# EAGLE design CSNE_Hirose_TDT_AdptBrd (EAGLE 7.4.0)

## Sheet 1 of 4
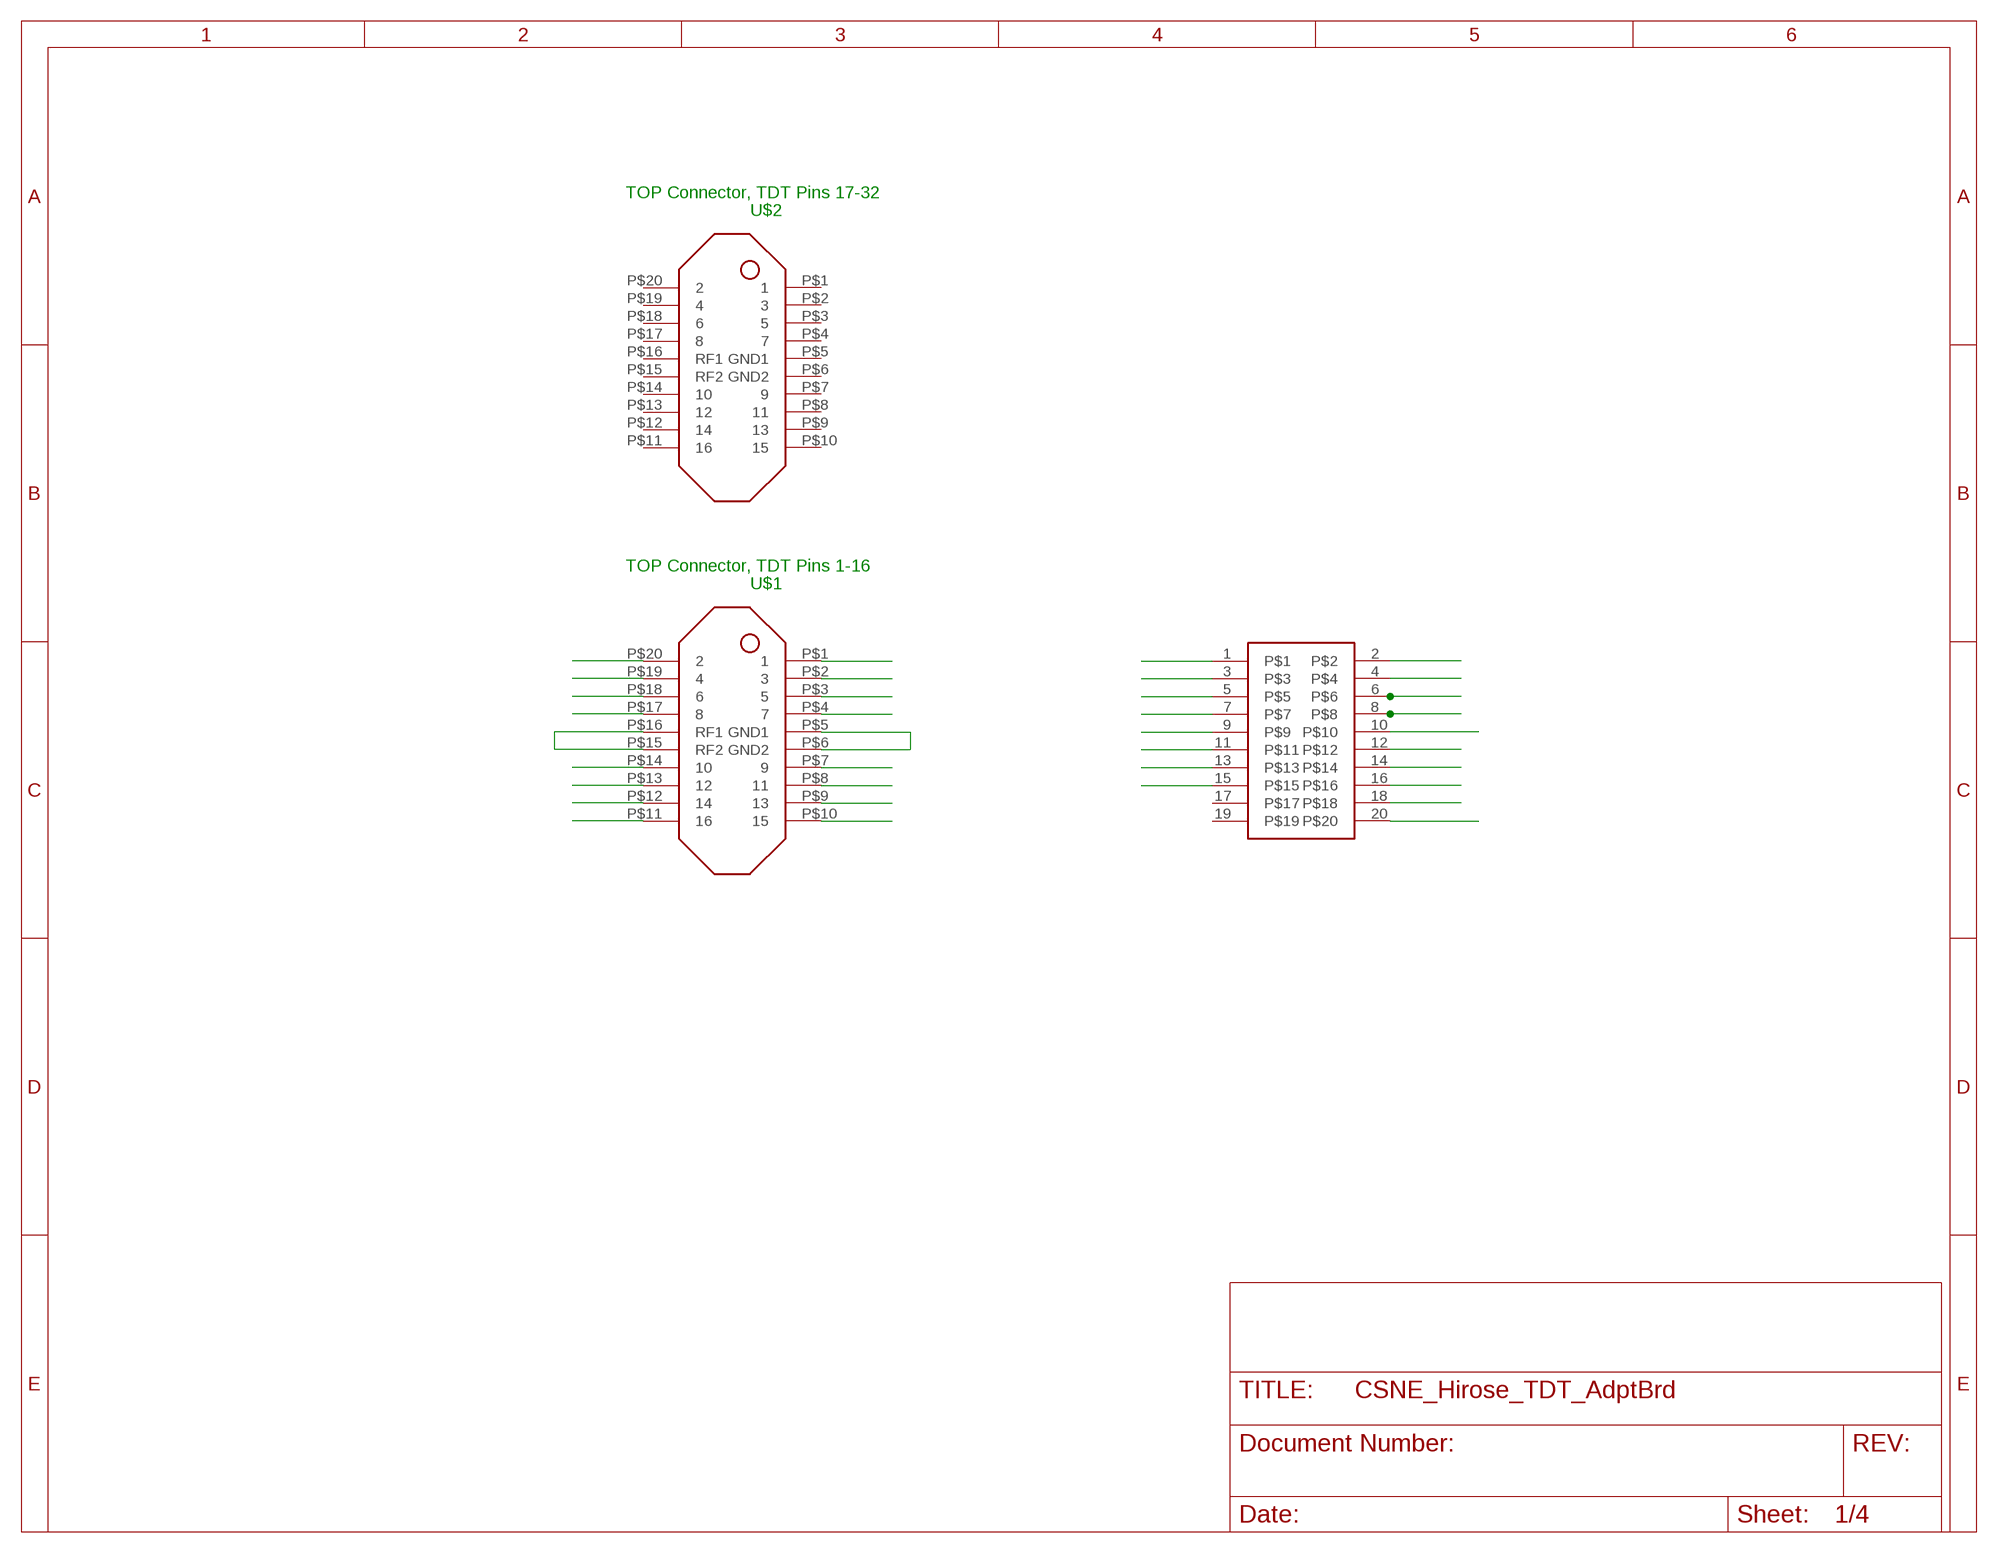
[diagram p0: schematic, sheet 1]

### Parts
U$1  DF30_HEADER  [DF30FC-20DP-0.4V]
U$2  DF30_HEADER  [DF30FC-20DP-0.4V]
U$3  CON-DF17-20F  [CON-DF17-20F]

### Nets
N$1: U$1.P$1 U$3.1
N$2: U$1.P$2 U$3.3
N$3: U$1.P$3 U$3.5
N$4: U$1.P$4 U$3.7
N$5: U$1.P$5(GND1) U$1.P$6(GND2) U$3.20
N$7: U$1.P$7 U$3.9
N$8: U$1.P$8 U$3.11
N$9: U$1.P$9 U$3.13
N$10: U$1.P$10 U$3.15
N$11: U$1.P$11 U$3.18
N$12: U$1.P$12 U$3.16
N$13: U$1.P$13 U$3.14
N$14: U$1.P$14 U$3.12
N$16: U$1.P$15(RF2) U$1.P$16(RF1) U$3.10
N$17: U$1.P$17 U$3.8
N$18: U$1.P$18 U$3.6
N$19: U$1.P$19 U$3.4
N$20: U$1.P$20 U$3.2
Unconnected: U$2.P$1 U$2.P$2 U$2.P$3 U$2.P$4 U$2.P$5(GND1) U$2.P$6(GND2) U$2.P$7 U$2.P$8 U$2.P$9 U$2.P$10 U$2.P$11 U$2.P$12 U$2.P$13 U$2.P$14 U$2.P$15(RF2) U$2.P$16(RF1) U$2.P$17 U$2.P$18 U$2.P$19 U$2.P$20 U$3.17 U$3.19

### Notes on the sheet
- TOP Connector, TDT Pins 17-32
- U$2
- TOP Connector, TDT Pins 1-16
- U$1

## Sheet 2 of 4

## Sheet 3 of 4

## Sheet 4 of 4

## Library data of the parts
U$1 U$2 = TDT_Connectors:DF30_HEADER
U$3 = hirose_DF17:CON-DF17-20F

## Board
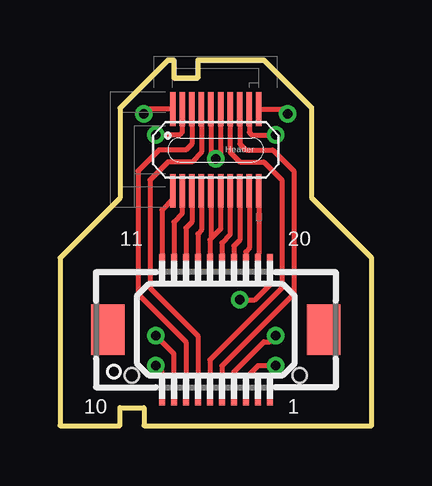
[diagram p1: board, top side]
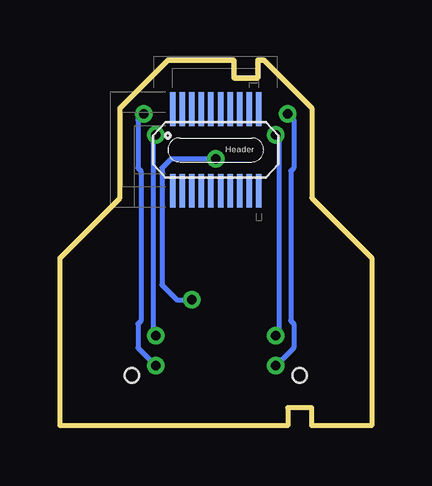
[diagram p2: board, bottom side, seen from below]

Size 13 x 15.25 mm. Coordinates in mm from the lower left corner, seen from the top.
Outline: 2.5,13.25 2.5,9.5 0,7 0,0 2.5,0 2.5,0.75 3.5,0.75 3.5,0 13,0 13,7 10.5,9.5 10.5,13.25 8.5,15.25 5.75,15.25 5.75,14.5 4.75,14.5 4.75,15.25 4.5,15.25 2.5,13.25
Copper layers (1*2*15*16): Top 0.035mm / dielectric 0.45mm / Route2 0.035mm / dielectric 0.5mm / Route15 0.035mm / dielectric 0.45mm / Bottom 0.035mm
Design rules "LaenPCBOrder_MOD_4layer": minimum track width 6mil, minimum drill 13mil, track to track 6mil, track to pad 6mil, pad to pad 6mil, via to via 6mil, smd to smd 6mil, copper to edge 15mil, drill to drill 6mil, minimum pad ring 7mil, minimum via ring 7mil, stop-mask expansion 3mil, vias tented up to drill 0mil, thermal gap 10mil

### Footprints (pad centres in the part's own frame; a part is rotated, then mirrored left to right if it is on the bottom)
DF30FC-20DP-0.4V = smd 0.23 x 1.4: P$1 -1.8,1.7; P$2 -1.4,1.7; P$3 -1,1.7; P$4 -0.6,1.7; P$5 -0.2,1.7; P$6 0.2,1.7; P$7 0.6,1.7; P$8 1,1.7; P$9 1.4,1.7; P$10 1.8,1.7; P$11 1.8,-1.7; P$12 1.4,-1.7; P$13 1,-1.7; P$14 0.6,-1.7; P$15 0.2,-1.7; P$16 -0.2,-1.7; P$17 -0.6,-1.7; P$18 -1,-1.7; P$19 -1.4,-1.7; P$20 -1.8,-1.7
CON-DF17-20F = smd 0.25 x 1.1: 1 -2.25,-2.6; 2 -2.25,2.6; 3 -1.75,-2.6; 4 -1.75,2.6; 5 -1.25,-2.6; 6 -1.25,2.6; 7 -0.75,-2.6; 8 -0.75,2.6; 9 -0.25,-2.6; 10 -0.25,2.6; 11 0.25,-2.6; 12 0.25,2.6; 13 0.75,-2.6; 14 0.75,2.6; 15 1.25,-2.6; 16 1.25,2.6; 17 1.75,-2.6; 18 1.75,2.6; 19 2.25,-2.6; 20 2.25,2.6 | smd 1.4 x 2.1: SIT1 -4.5,0; SIT2 4.5,0 | hole 0.6: -3.5,-1.9; 3.5,-1.9

### Placement (x,y rotation side)
U$1  6.5,11.5 0 top
U$2  6.5,11.5 0 bottom
U$3  6.5,4 0 top

### Tracks (layer width: path | path; a pad name or v marks a point on that pad's centre or on a via)
N$1  (via drill 0.38)
  Top 0.203: U$1.P$1 3.7,13.2 v3.5,13 | U$3.1 4.25,2.25 v4,2.5
  Bottom 0.203: v3.5,13 3.25,12.75 3.25,10.75 3.38,10.62 3.38,4.38 3.25,4.25 3.25,3.25 v4,2.5
N$2  (via drill 0.38)
  Top 0.203: U$1.P$2 5.1,12.22 5,12.12 v4,12.12 | U$3.3 4.75,3 v4,3.75
  Bottom 0.203: v4,12.12 3.88,12 3.88,3.88 v4,3.75
N$3
  Top 0.203: U$1.P$3 5.5,11.75 5.25,11.5 4.12,11.5 3.25,10.62 3.25,5.5 5.25,3.5 U$3.5
N$4
  Top 0.203: U$1.P$4 5.9,11.4 5.5,11 4.5,11 3.75,10.25 3.75,5.75 5.75,3.75 U$3.7
N$5  (via drill 0.38)
  Top 0.203: U$1.P$5 6.3,11.32 v6.5,11.12 6.7,11.32 U$1.P$6 | v7.5,5.25 8.12,5.25 8.75,5.88 U$3.20
  Bottom 0.203: v6.5,11.12 8.38,11.12 8.75,10.75 8.75,5.88 8.12,5.25 v7.5,5.25
N$7
  Top 0.203: U$1.P$7 7.1,11.4 7.5,11 8.5,11 9.25,10.25 9.25,5.75 6.25,2.75 U$3.9
N$8
  Top 0.203: U$1.P$8 7.5,11.75 7.75,11.5 8.88,11.5 9.75,10.62 9.75,5.5 6.75,2.5 U$3.11
N$9  (via drill 0.38)
  Top 0.203: U$1.P$9 7.9,12.22 8,12.12 v9,12.12 | U$3.13 7.25,2.25 8.5,3.5 8.75,3.5 v9,3.75
  Bottom 0.203: v9,12.12 9.12,12 9.12,3.88 v9,3.75
N$10  (via drill 0.38)
  Top 0.203: U$1.P$10 9.3,13.2 v9.5,13 | v9,2.5 8.25,2.5 7.75,2 U$3.15
  Bottom 0.203: v9.5,13 9.75,12.75 9.75,10.75 9.62,10.62 9.62,4.38 9.75,4.25 9.75,3.25 v9,2.5
N$11
  Top 0.203: U$1.P$11 8.3,7.17 8.25,7.12 U$3.18
N$12
  Top 0.203: U$1.P$12 7.9,7.4 7.75,7.25 U$3.16
N$13
  Top 0.203: U$1.P$13 7.5,7.75 7.25,7.5 U$3.14
N$14
  Top 0.203: U$1.P$14 7.1,7.97 6.75,7.62 U$3.12
N$16
  Top 0.203: U$1.P$16 6.3,7.8 | 6.3,7.8 6.25,7.75 U$3.10 | U$1.P$15 6.7,8.2 6.3,7.8
N$17
  Top 0.203: U$1.P$17 5.9,8.15 5.75,8 U$3.8
N$18
  Top 0.203: U$1.P$18 5.5,8.5 5.25,8.25 U$3.6
N$19
  Top 0.203: U$1.P$19 5.1,8.85 4.75,8.5 U$3.4
N$20
  Top 0.203: U$1.P$20 4.7,9.45 4.25,9 U$3.2

### Text on the board
tNames: 11 | 20 | 10 | 1